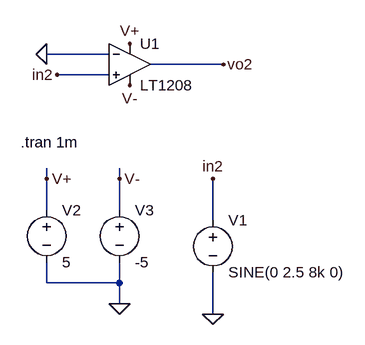
[diagram p0: schematic ETAJ 4 OUTPUT SWING.asc]
ETAJ 4 OUTPUT SWING.asc, the LTspice schematic file:
Version 4
SHEET 1 880 680
WIRE 0 160 -96 160
WIRE 176 176 64 176
WIRE 0 192 -80 192
WIRE -96 352 -96 336
WIRE 16 352 16 336
WIRE -96 400 -96 352
WIRE 16 400 16 352
WIRE 160 416 160 352
WIRE -96 512 -96 480
WIRE 16 512 16 480
WIRE 16 512 -96 512
WIRE 16 544 16 512
WIRE 160 560 160 496
FLAG 32 208 V-
FLAG 32 144 V+
FLAG 160 560 0
FLAG 160 352 in2
FLAG -80 192 in2
FLAG 176 176 vo2
FLAG -96 160 0
FLAG 16 544 0
FLAG -96 352 V+
FLAG 16 352 V-
SYMBOL OpAmps\\LT1208 32 112 R0
SYMATTR InstName U1
SYMBOL voltage 160 400 R0
WINDOW 123 0 0 Left 2
WINDOW 39 0 0 Left 2
SYMATTR InstName V1
SYMATTR Value SINE(0 2.5 8k 0)
SYMBOL voltage -96 384 R0
WINDOW 123 0 0 Left 2
WINDOW 39 0 0 Left 2
SYMATTR InstName V2
SYMATTR Value 5
SYMBOL voltage 16 384 R0
WINDOW 123 0 0 Left 2
WINDOW 39 0 0 Left 2
SYMATTR InstName V3
SYMATTR Value -5
TEXT -136 296 Left 2 !.tran 1m

The netlist it stands for:
* ETAJ 4 OUTPUT SWING.asc
XU1 in2 0 V+ V- vo2 LT1208  ; pins In+ In- V+ V- OUT
V1 in2 0 SINE(0 2.5 8k 0)
V2 V+ 0 5
V3 V- 0 -5
.tran 1m
.backanno
.end